# Altium schematic sheet ASIC.SchDoc
size A
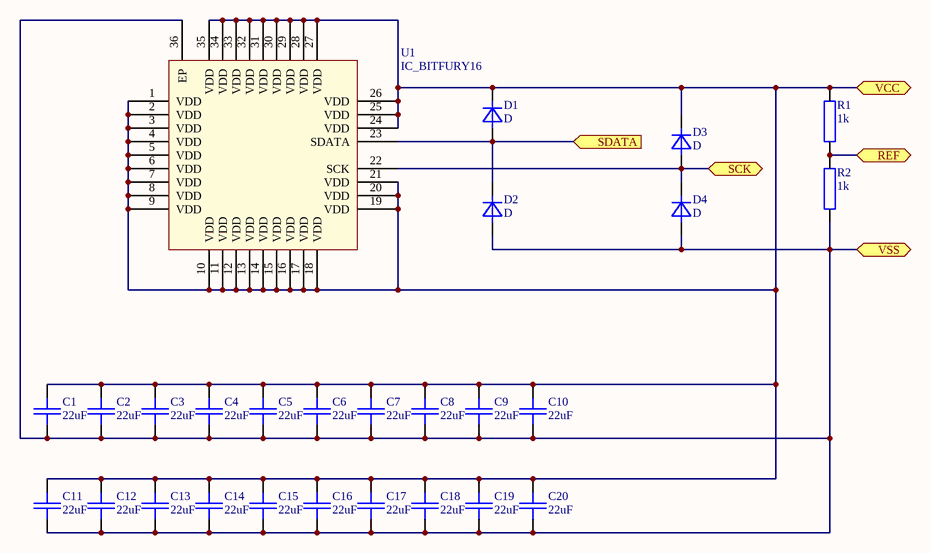
[diagram p0: ASIC.SchDoc]

## Parts
C1  22uF  [SMD_0805_CAPC2012X95N]
C2  22uF  [SMD_0805_CAPC2012X95N]
C3  22uF  [SMD_0805_CAPC2012X95N]
C4  22uF  [SMD_0805_CAPC2012X95N]
C5  22uF  [SMD_0805_CAPC2012X95N]
C6  22uF  [SMD_0805_CAPC2012X95N]
C7  22uF  [SMD_0805_CAPC2012X95N]
C8  22uF  [SMD_0805_CAPC2012X95N]
C9  22uF  [SMD_0805_CAPC2012X95N]
C10  22uF  [SMD_0805_CAPC2012X95N]
C11  22uF  [SMD_0805_CAPC2012X95N]
C12  22uF  [SMD_0805_CAPC2012X95N]
C13  22uF  [SMD_0805_CAPC2012X95N]
C14  22uF  [SMD_0805_CAPC2012X95N]
C15  22uF  [SMD_0805_CAPC2012X95N]
C16  22uF  [SMD_0805_CAPC2012X95N]
C17  22uF  [SMD_0805_CAPC2012X95N]
C18  22uF  [SMD_0805_CAPC2012X95N]
C19  22uF  [SMD_0805_CAPC2012X95N]
C20  22uF  [SMD_0805_CAPC2012X95N]
D1  D  [SMD_SOD523_SOD1608X65N]
D2  D  [SMD_SOD523_SOD1608X65N]
D3  D  [SMD_SOD523_SOD1608X65N]
D4  D  [SMD_SOD523_SOD1608X65N]
R1  1k  [SMD_0603_RESC1608X55N]
R2  1k  [SMD_0603_RESC1608X55N]
U1  IC_BITFURY16  [SMD_QFN65P600X600X100-36AN]

## Ports
REF, SCK, SDATA (in), VCC, VSS

## Nets
REF: R1.2 R2.1 ; port REF
SCK: D3.2(A) D4.1(C) U1.22(SCK) ; port SCK
SDATA: D1.2(A) D2.1(C) U1.23(SDATA) ; port SDATA
VCC: C1.1 C2.1 C3.1 C4.1 C5.1 C6.1 C7.1 C8.1 C9.1 C10.1 C11.1 C12.1 C13.1 C14.1 C15.1 C16.1 C17.1 C18.1 C19.1 C20.1 D1.1(C) D3.1(C) R1.1 U1.1(VDD) U1.2(VDD) U1.3(VDD) U1.4(VDD) U1.5(VDD) U1.6(VDD) U1.7(VDD) U1.8(VDD) U1.9(VDD) U1.10(VDD) U1.11(VDD) U1.12(VDD) U1.13(VDD) U1.14(VDD) U1.15(VDD) U1.16(VDD) U1.17(VDD) U1.18(VDD) U1.19(VDD) U1.20(VDD) U1.21(VDD) U1.24(VDD) U1.25(VDD) U1.26(VDD) U1.27(VDD) U1.28(VDD) U1.29(VDD) U1.30(VDD) U1.31(VDD) U1.32(VDD) U1.33(VDD) U1.34(VDD) U1.35(VDD) ; port VCC
VSS: C1.2 C2.2 C3.2 C4.2 C5.2 C6.2 C7.2 C8.2 C9.2 C10.2 C11.2 C12.2 C13.2 C14.2 C15.2 C16.2 C17.2 C18.2 C19.2 C20.2 D2.2(A) D4.2(A) R2.2 U1.36(EP) ; port VSS

## Library data of the parts
C1-C20 = C: NOTE: <NOTE>
D1-D4 = D: NOTE: <NOTE>
R1 R2 = R: NOTE: <NOTE>; R_BDS: R
U1 = IC_BITFURY16: BitFury 2016 16 nm